# Altium project Battery capacity meter_board.PrjPcb
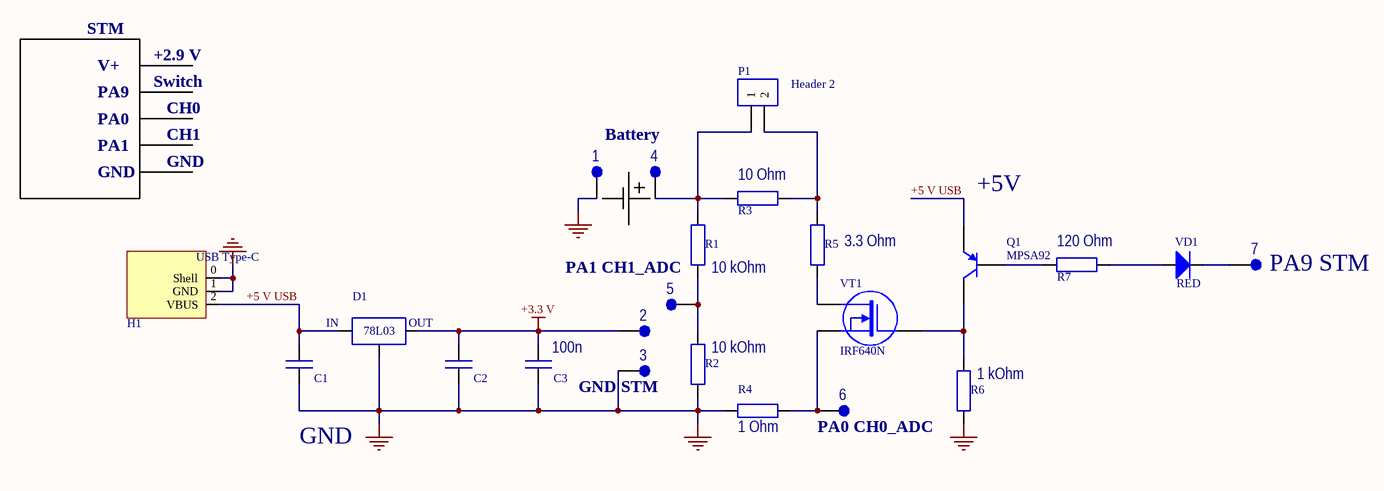
[diagram p0: Battery capacity meter_board.SchDoc]
1 sheet, 23 parts. Net scope: global (net labels, ports and power ports of the same name join across sheets).
Board file: Battery capacity meter_board.PcbDoc

## Sheet Battery capacity meter_board.SchDoc
size A3

### Parts
1  .  [Hole]
2  .  [Hole]
3  .  [Hole]
4  .  [Hole]
5  .  [Hole]
6  .  [Hole]
7  .  [Hole]
C1  Capacitor  [C1206]  (value not drawn)
C2  Capacitor  [C1206]  (value not drawn)
C3  Capacitor  [C1206]  (value not drawn)
D1  78L03  [SOT89M]  (value not drawn)
H1  USB Type-C  [USB Type-C]  (value not drawn)
P1  Header 2  [2pin]
Q1  MPSA92  [NPN]
R1  Rezistor_10k  [2512]  (value not drawn)
R2  Rezistor_10k  [2512]  (value not drawn)
R3  Rezistor_Ceramic_20W  [Resistor_Ceramic_20W]  (value not drawn)
R4  Rezistor_Ceramic_20W  [Resistor_Ceramic_20W]  (value not drawn)
R5  Rezistor_Ceramic_20W  [Resistor_Ceramic_20W]  (value not drawn)
R6  Rezistor_10k  [2512]  (value not drawn)
R7  Rezistor_120  [for 120 Ohm]  (value not drawn)
VD1  RED  [Light_Diode]
VT1  IRF640N  [TO-220AB]

### Nets
+3.3 V: 2.1 C2.2 C3.2 D1.1
GND: 1.1 3.1 C1.1 C2.1 C3.1 D1.2 H1.0(Shell) H1.1(GND) R2.1 R4.1 R6.1
+5 V USB: C1.2 D1.3 H1.2(VBUS) Q1.1(E)
Net4_1: 4.1 P1.1 R1.2 R3.1
Net5_1: 5.1 R1.1 R2.2
Net6_1: 6.1 R4.2 VT1.3(S)
Net7_1: 7.1 VD1.2(K)
NetP1_2: P1.2 R3.2 R5.2
NetQ1_2: Q1.2(C) R6.2 VT1.1(G)
NetQ1_3: Q1.3(B) R7.1
NetR5_1: R5.1 VT1.2(D)
NetR7_2: R7.2 VD1.1(A)

### Notes on the sheet
- STM
- V+
- +2.9 V
- Switch
- PA9
- PA1
- PA0
- CH1
- CH0
- Battery
- GND
- (near R3) 10 Ohm
- +5V
- PA1 CH1_ADC
- (near R1) 10 kOhm
- (near R5) 3.3 Ohm
- (near R7) 120 Ohm
- (near 7) PA9 STM
- (near C3) 100n
- (near R2) 10 kOhm
- (near 3) GND STM
- (near R6) 1 kOhm
- (near R4) 1 Ohm
- (near 6) PA0 CH0_ADC
- (in symbol 78L03) IN; OUT

### Library data of the parts
1-7 = KT: Part Number: КТ_DIP_1,1; ValueType: Контрольная точка
D1 = 78L03: Note: Pin 2 is not connected and not drawn.; Published: 8-Jun-2000; LatestRevisionDate: 29-May-2009; LatestRevisionNote: IPC-7351 Footprint Added.; DatasheetVersion: Jan-1998; PackageVersion: 1996; PackageReference: SOT23A; Publisher: Altium Limited; PackageDescription: 3-Pin SOT-23 Package 0.95 mm Pitch, 2.3 mm Lead Span - Reverse Pinning; ComponentLink1Description: Manufacturer Link; ComponentLink1URL: http://www.zetex.com/
P1 = Header 2: Header, 2-Pin; LatestRevisionDate: 17-Jul-2002; LatestRevisionNote: Re-released for DXP Platform.; Publisher: Altium Limited
Q1 = MPSA92: PNP
R1 R2 R6 = Rezistor_10k: Rezistor
R7 = Rezistor_120: Rezistor
VD1 = HER106
VT1 = IRF740